# Altium schematic sheet Top_Level.SchDoc
size B; SheetNumber: 1; SheetTotal: 10
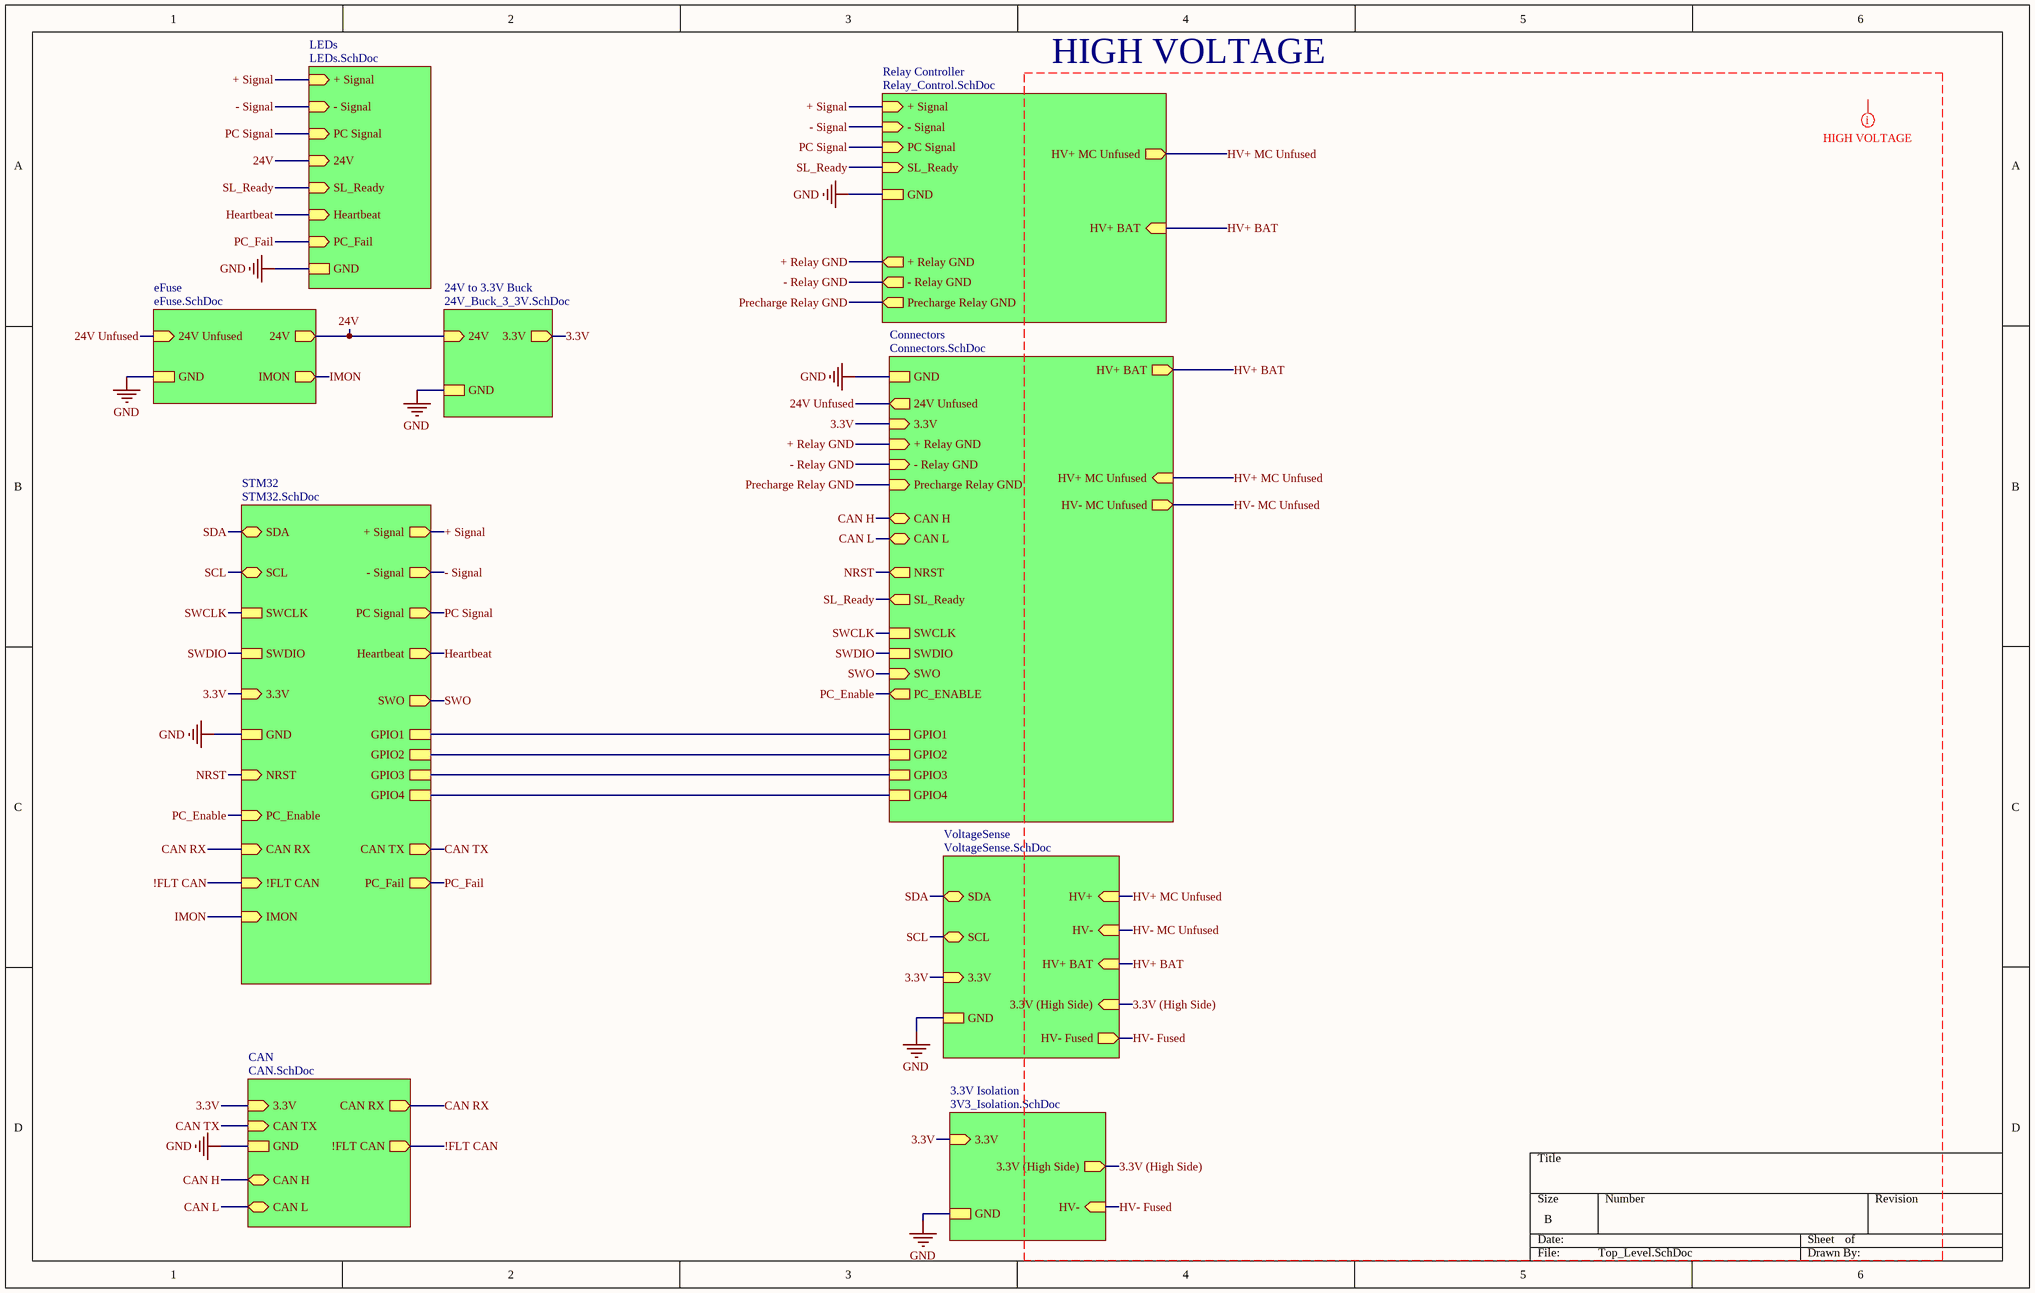
[diagram p0: Top_Level.SchDoc]

## Sub-sheets
3.3V Isolation = 3V3_Isolation.SchDoc: GND, 3.3V (in), 3.3V (High Side) (out), HV- (in)
24V to 3.3V Buck = 24V_Buck_3_3V.SchDoc: 24V (in), GND, 3.3V (out)
CAN = CAN.SchDoc: 3.3V (in), GND, CAN RX (out), CAN TX (in), !FLT CAN (out), CAN H (bidir), CAN L (bidir)
Connectors = Connectors.SchDoc: GND, + Relay GND (in), - Relay GND (in), Precharge Relay GND (in), HV+ BAT (out), 24V Unfused (out), HV+ MC Unfused (in), HV- MC Unfused (out), 3.3V (in), SWCLK, SWDIO, SWO (in), NRST (out), GPIO1, GPIO2, GPIO3, GPIO4, PC_ENABLE (out), CAN H (bidir), CAN L (bidir), SL_Ready (out)
eFuse = eFuse.SchDoc: 24V Unfused (in), GND, 24V (out), IMON (out)
LEDs = LEDs.SchDoc: + Signal (in), - Signal (in), PC Signal (in), 24V (in), GND, SL_Ready (in), Heartbeat (in), PC_Fail (in)
Relay Controller = Relay_Control.SchDoc: + Signal (in), - Signal (in), PC Signal (in), SL_Ready (in), GND, + Relay GND (out), - Relay GND (out), Precharge Relay GND (out), HV+ MC Unfused (out), HV+ BAT (in)
STM32 = STM32.SchDoc: SDA (bidir), SCL (bidir), 3.3V (in), + Signal (out), - Signal (out), PC Signal (out), GND, SWCLK, SWDIO, SWO (out), NRST (in), GPIO1, GPIO2, GPIO3, GPIO4, PC_Enable (in), CAN TX (out), CAN RX (in), Heartbeat (out), !FLT CAN (in), IMON (in), PC_Fail (out)
VoltageSense = VoltageSense.SchDoc: HV+ (in), HV- (in), 3.3V (in), SDA (bidir), SCL (bidir), GND, 3.3V (High Side) (in), HV- Fused (out), HV+ BAT (in)

## Nets
GND: sheet Relay Controller/GND, sheet Connectors/GND, sheet LEDs/GND, sheet STM32/GND, sheet VoltageSense/GND, sheet eFuse/GND, sheet 24V to 3.3V Buck/GND, sheet 3.3V Isolation/GND, sheet CAN/GND
3.3V: sheet Connectors/3.3V, sheet STM32/3.3V, sheet VoltageSense/3.3V, sheet 24V to 3.3V Buck/3.3V, sheet 3.3V Isolation/3.3V, sheet CAN/3.3V
3.3V (High Side): sheet VoltageSense/3.3V (High Side), sheet 3.3V Isolation/3.3V (High Side)
24V: sheet LEDs/24V, sheet eFuse/24V, sheet 24V to 3.3V Buck/24V
24V Unfused: sheet Connectors/24V Unfused, sheet eFuse/24V Unfused
!FLT CAN: sheet STM32/!FLT CAN, sheet CAN/!FLT CAN
+ Relay GND: sheet Relay Controller/+ Relay GND, sheet Connectors/+ Relay GND
+ Signal: sheet Relay Controller/+ Signal, sheet LEDs/+ Signal, sheet STM32/+ Signal
- Relay GND: sheet Relay Controller/- Relay GND, sheet Connectors/- Relay GND
- Signal: sheet Relay Controller/- Signal, sheet LEDs/- Signal, sheet STM32/- Signal
CAN H: sheet Connectors/CAN H, sheet CAN/CAN H
CAN L: sheet Connectors/CAN L, sheet CAN/CAN L
CAN RX: sheet STM32/CAN RX, sheet CAN/CAN RX
CAN TX: sheet STM32/CAN TX, sheet CAN/CAN TX
Heartbeat: sheet LEDs/Heartbeat, sheet STM32/Heartbeat
HV+ BAT: sheet Relay Controller/HV+ BAT, sheet Connectors/HV+ BAT, sheet VoltageSense/HV+ BAT
HV+ MC Unfused: sheet Relay Controller/HV+ MC Unfused, sheet Connectors/HV+ MC Unfused, sheet VoltageSense/HV+
HV- Fused: sheet VoltageSense/HV- Fused, sheet 3.3V Isolation/HV-
HV- MC Unfused: sheet Connectors/HV- MC Unfused, sheet VoltageSense/HV-
IMON: sheet STM32/IMON, sheet eFuse/IMON
NRST: sheet Connectors/NRST, sheet STM32/NRST
PC Signal: sheet Relay Controller/PC Signal, sheet LEDs/PC Signal, sheet STM32/PC Signal
PC_Enable: sheet Connectors/PC_ENABLE, sheet STM32/PC_Enable
PC_Fail: sheet LEDs/PC_Fail, sheet STM32/PC_Fail
Precharge Relay GND: sheet Relay Controller/Precharge Relay GND, sheet Connectors/Precharge Relay GND
SCL: sheet STM32/SCL, sheet VoltageSense/SCL
SDA: sheet STM32/SDA, sheet VoltageSense/SDA
SL_Ready: sheet Relay Controller/SL_Ready, sheet Connectors/SL_Ready, sheet LEDs/SL_Ready
SWCLK: sheet Connectors/SWCLK, sheet STM32/SWCLK
SWDIO: sheet Connectors/SWDIO, sheet STM32/SWDIO
SWO: sheet Connectors/SWO, sheet STM32/SWO
(unnamed): sheet Connectors/GPIO1, sheet STM32/GPIO1
(unnamed): sheet Connectors/GPIO2, sheet STM32/GPIO2
(unnamed): sheet Connectors/GPIO3, sheet STM32/GPIO3
(unnamed): sheet Connectors/GPIO4, sheet STM32/GPIO4

## Layout directives
mark named HIGH VOLTAGE: 3.3V (High Side), HV+ BAT, HV+ MC Unfused, HV- Fused, HV- MC Unfused

## Notes on the sheet
- HIGH VOLTAGE